# Altium schematic sheet white_noise.SchDoc
size A4
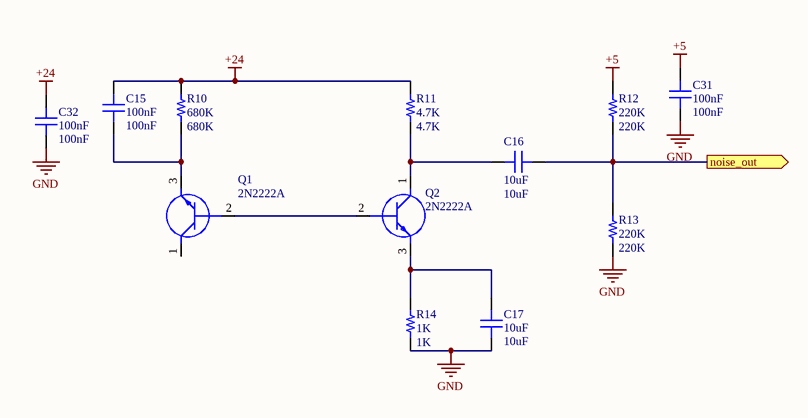
[diagram p0: white_noise.SchDoc]

## Parts
C15  100nF  [cap805]
C16  10uF  [cap805]
C17  10uF  [cap805]
C31  100nF  [cap805]
C32  100nF  [cap805]
Q1  2N2222A  [soT95p280x130-3n]
Q2  2N2222A  [soT95p280x130-3n]
R10  680K  [0603R]
R11  4.7K  [0603R]
R12  220K  [0603R]
R13  220K  [0603R]
R14  1K  [0603R]

## Ports
noise_out (out)

## Nets
+5: C31.1 R12.2
+24: C15.2 C32.1 R10.2 R11.2
GND: C17.1 C31.2 C32.2 R13.1 R14.1
noise_out: C16.1 R12.1 R13.2 ; port noise_out
NetC15_1: C15.1 Q1.3(E) R10.1
NetC16_2: C16.2 Q2.1(C) R11.1
NetC17_2: C17.2 Q2.3(E) R14.2
NetQ1_2: Q1.2(B) Q2.2(B)

Not connected (* = marked no-connect by the designer): Q1 1(C)

## Library data of the parts
C15-C17 C31 C32 = Capacitor: CAP SMD 0805; Part Number: C0805X106K9RAC7800
  C15 C31 C32: Value: 100nF
  C16 C17: Value: 10uF
Q1 Q2 = 2N2222A: Transistor BJT NPN SMD; pin to pad: 1>3 2>1 3>2; Manufacturer_Name: Foshan Blue Rocket Elec; Datasheet Link: https://datasheet.lcsc.com/szlcsc/1901291437_Foshan-Blue-Rocket-Elec-2N2222A_C358533.pdf; Height: 4.7mm; Manufacturer_Part_Number: 2N2222A
R10-R14 = Resistor: RES SMD 0603; Part Number: RCS0805100KFKEA
  R10: Value: 680K
  R11: Value: 4.7K
  R12 R13: Value: 220K
  R14: Value: 1K